# EasyEDA schematic SCH_ALL-IN-ONE_2025-01-04.json

## Sheets
1 power supply: TITLE: POWER SUPPLY; REV: 1.0; Date: 2024-12-06; Sheet: 1/1; Drawn By: jrvrcd; Company: Your Company
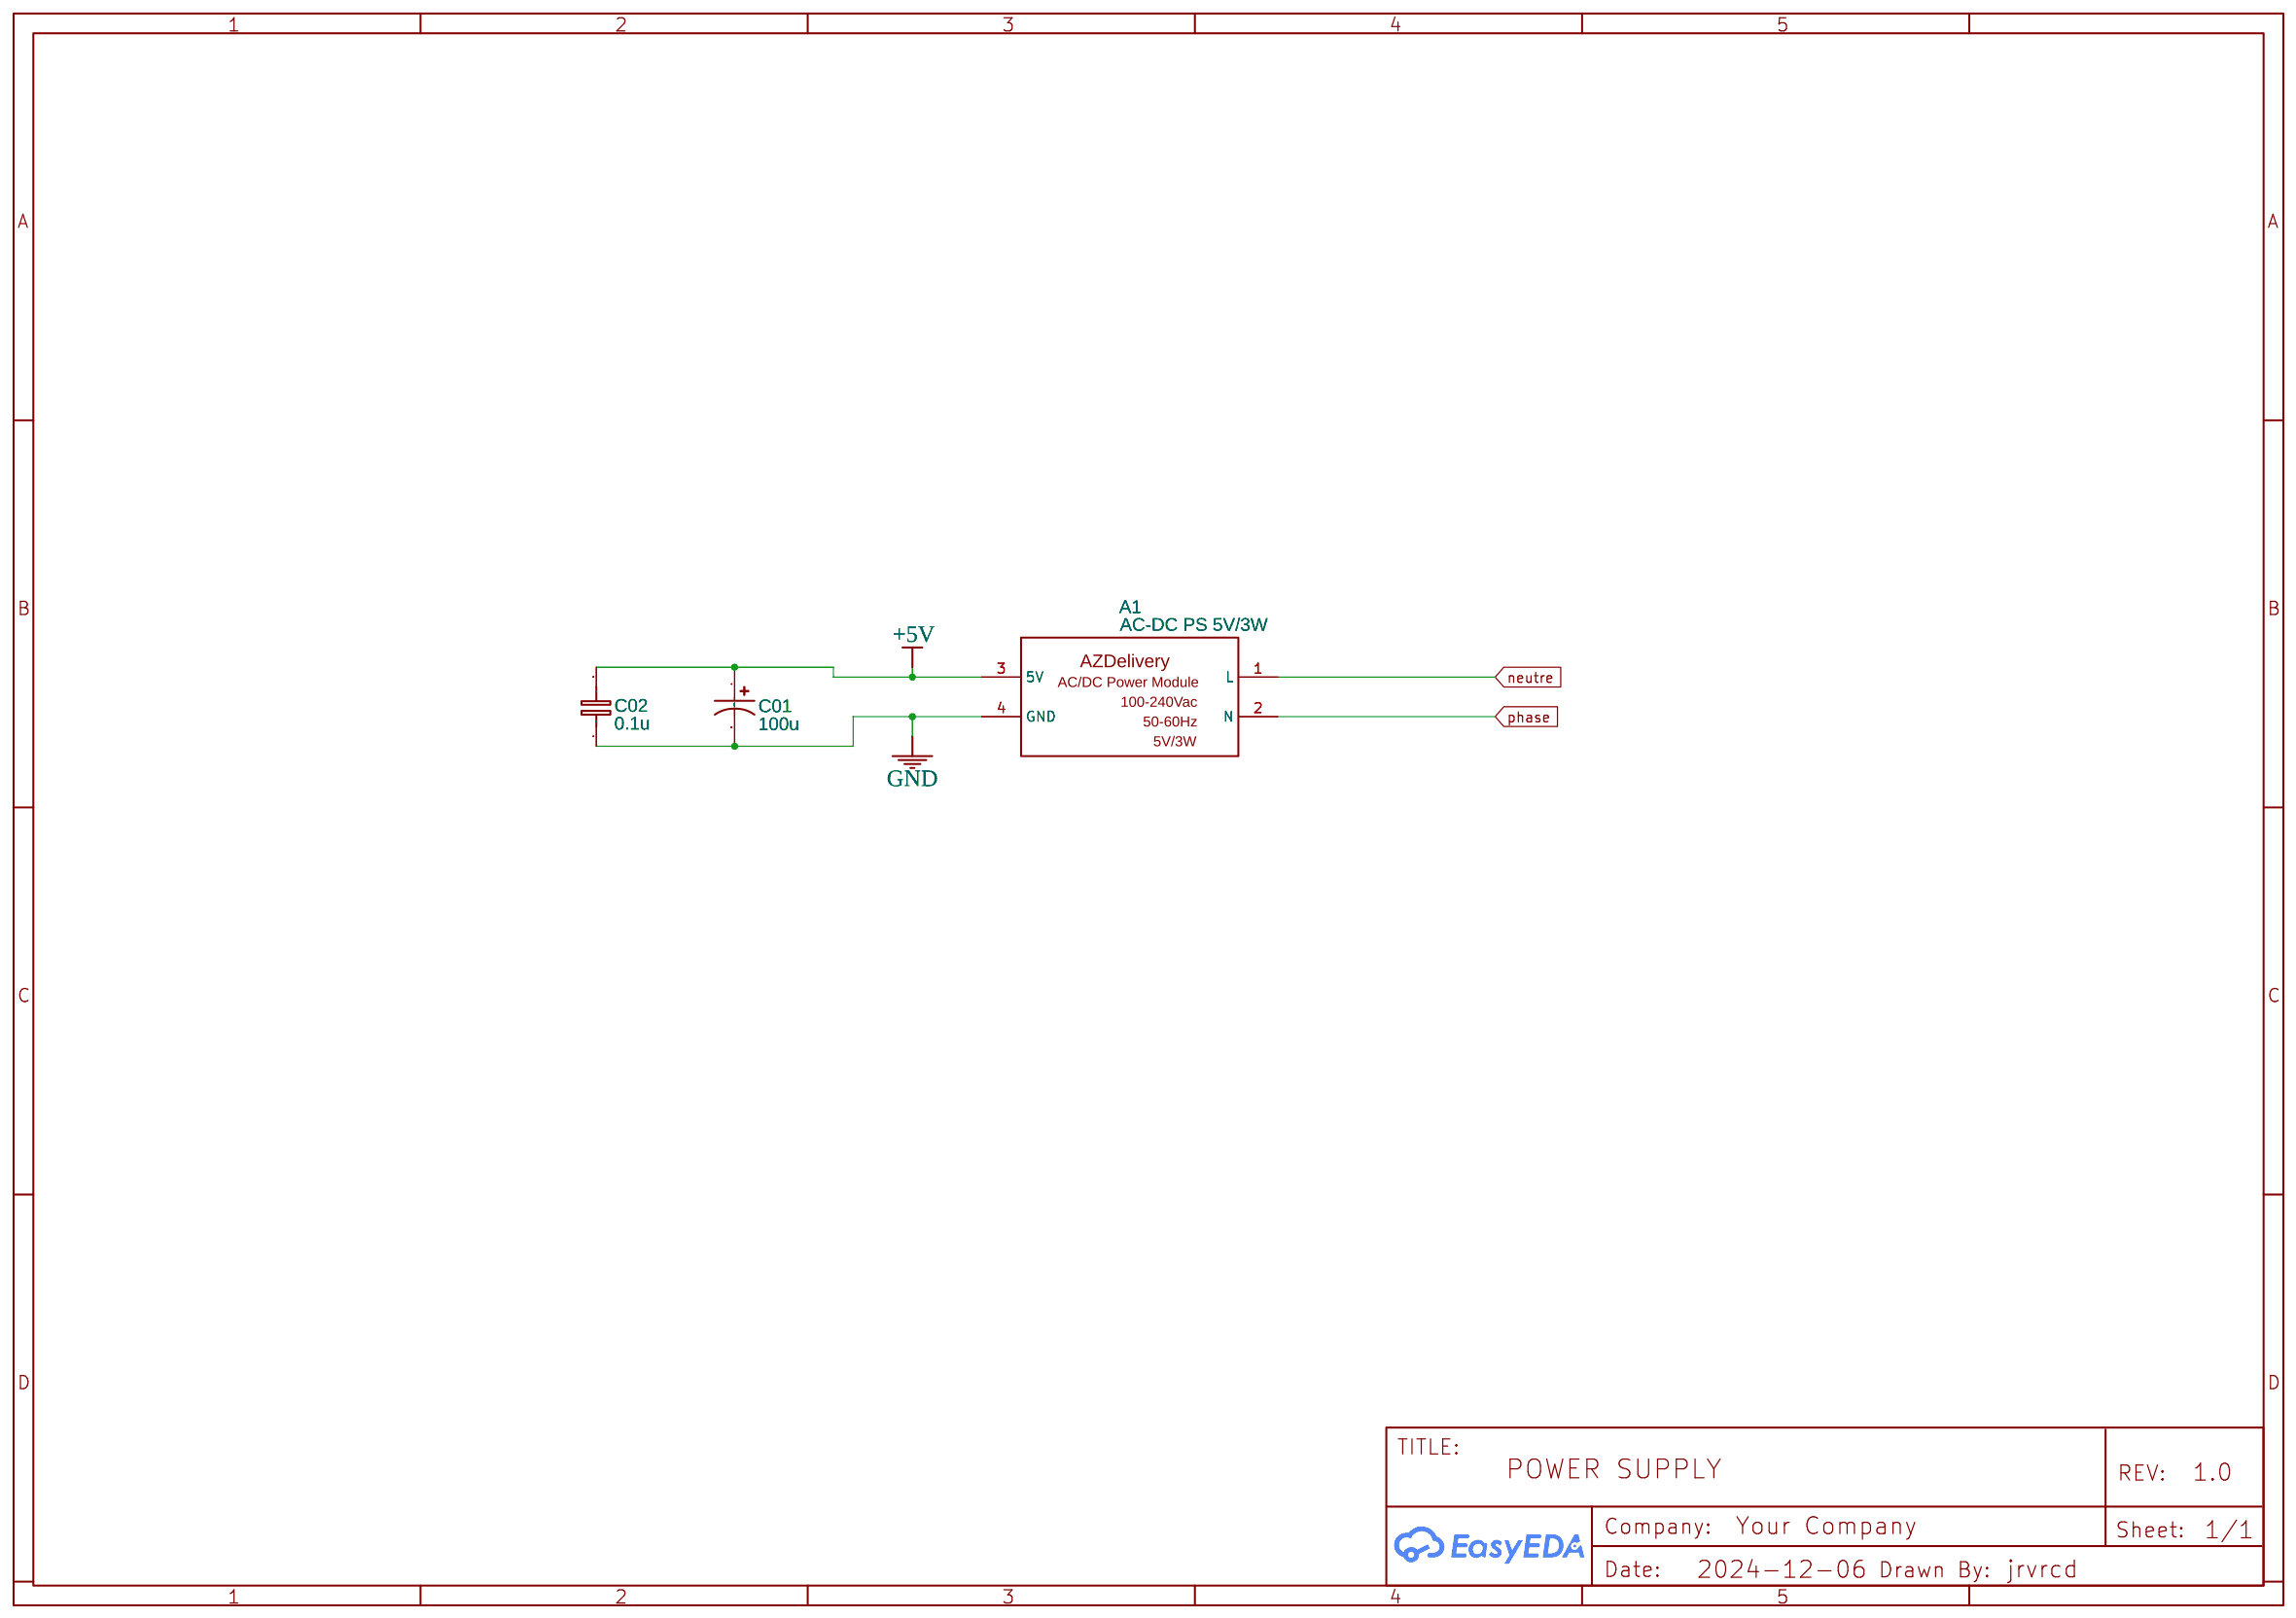
[diagram p0: power supply]
2 TIC SENSOR: TITLE: TIC SENSOR
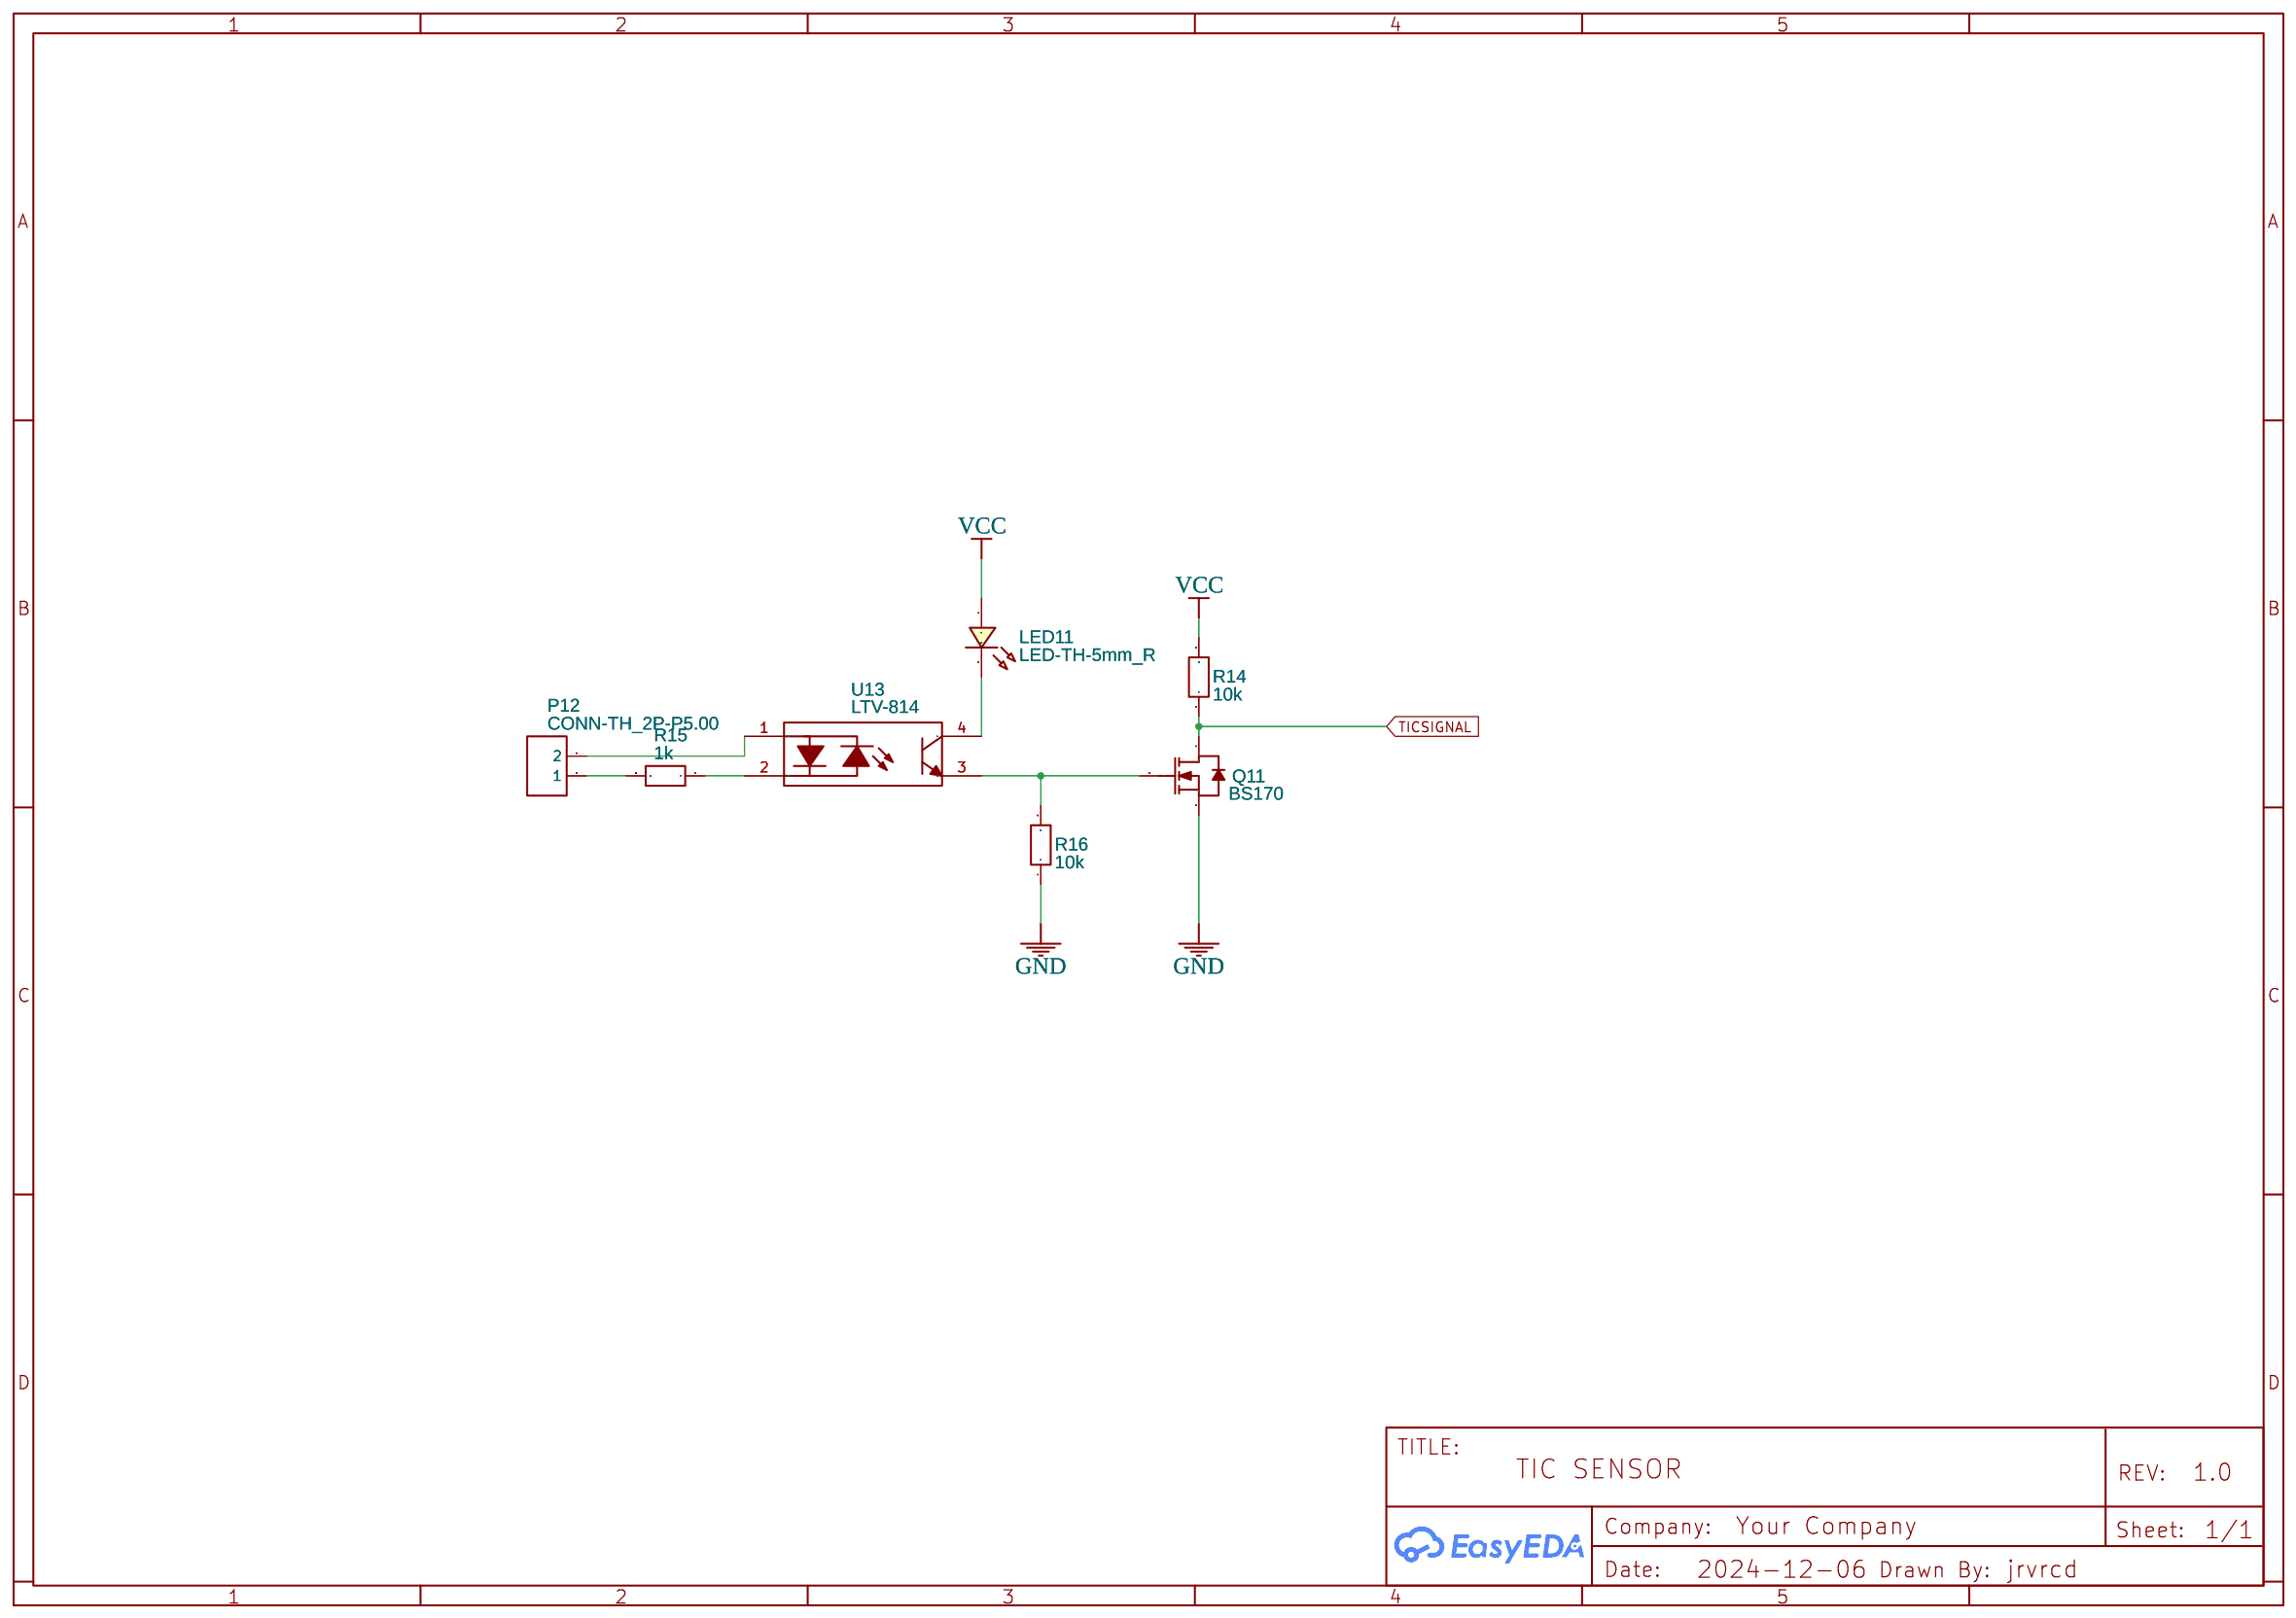
[diagram p1: TIC SENSOR]
3 POWER SENSOR: TITLE: power sensor
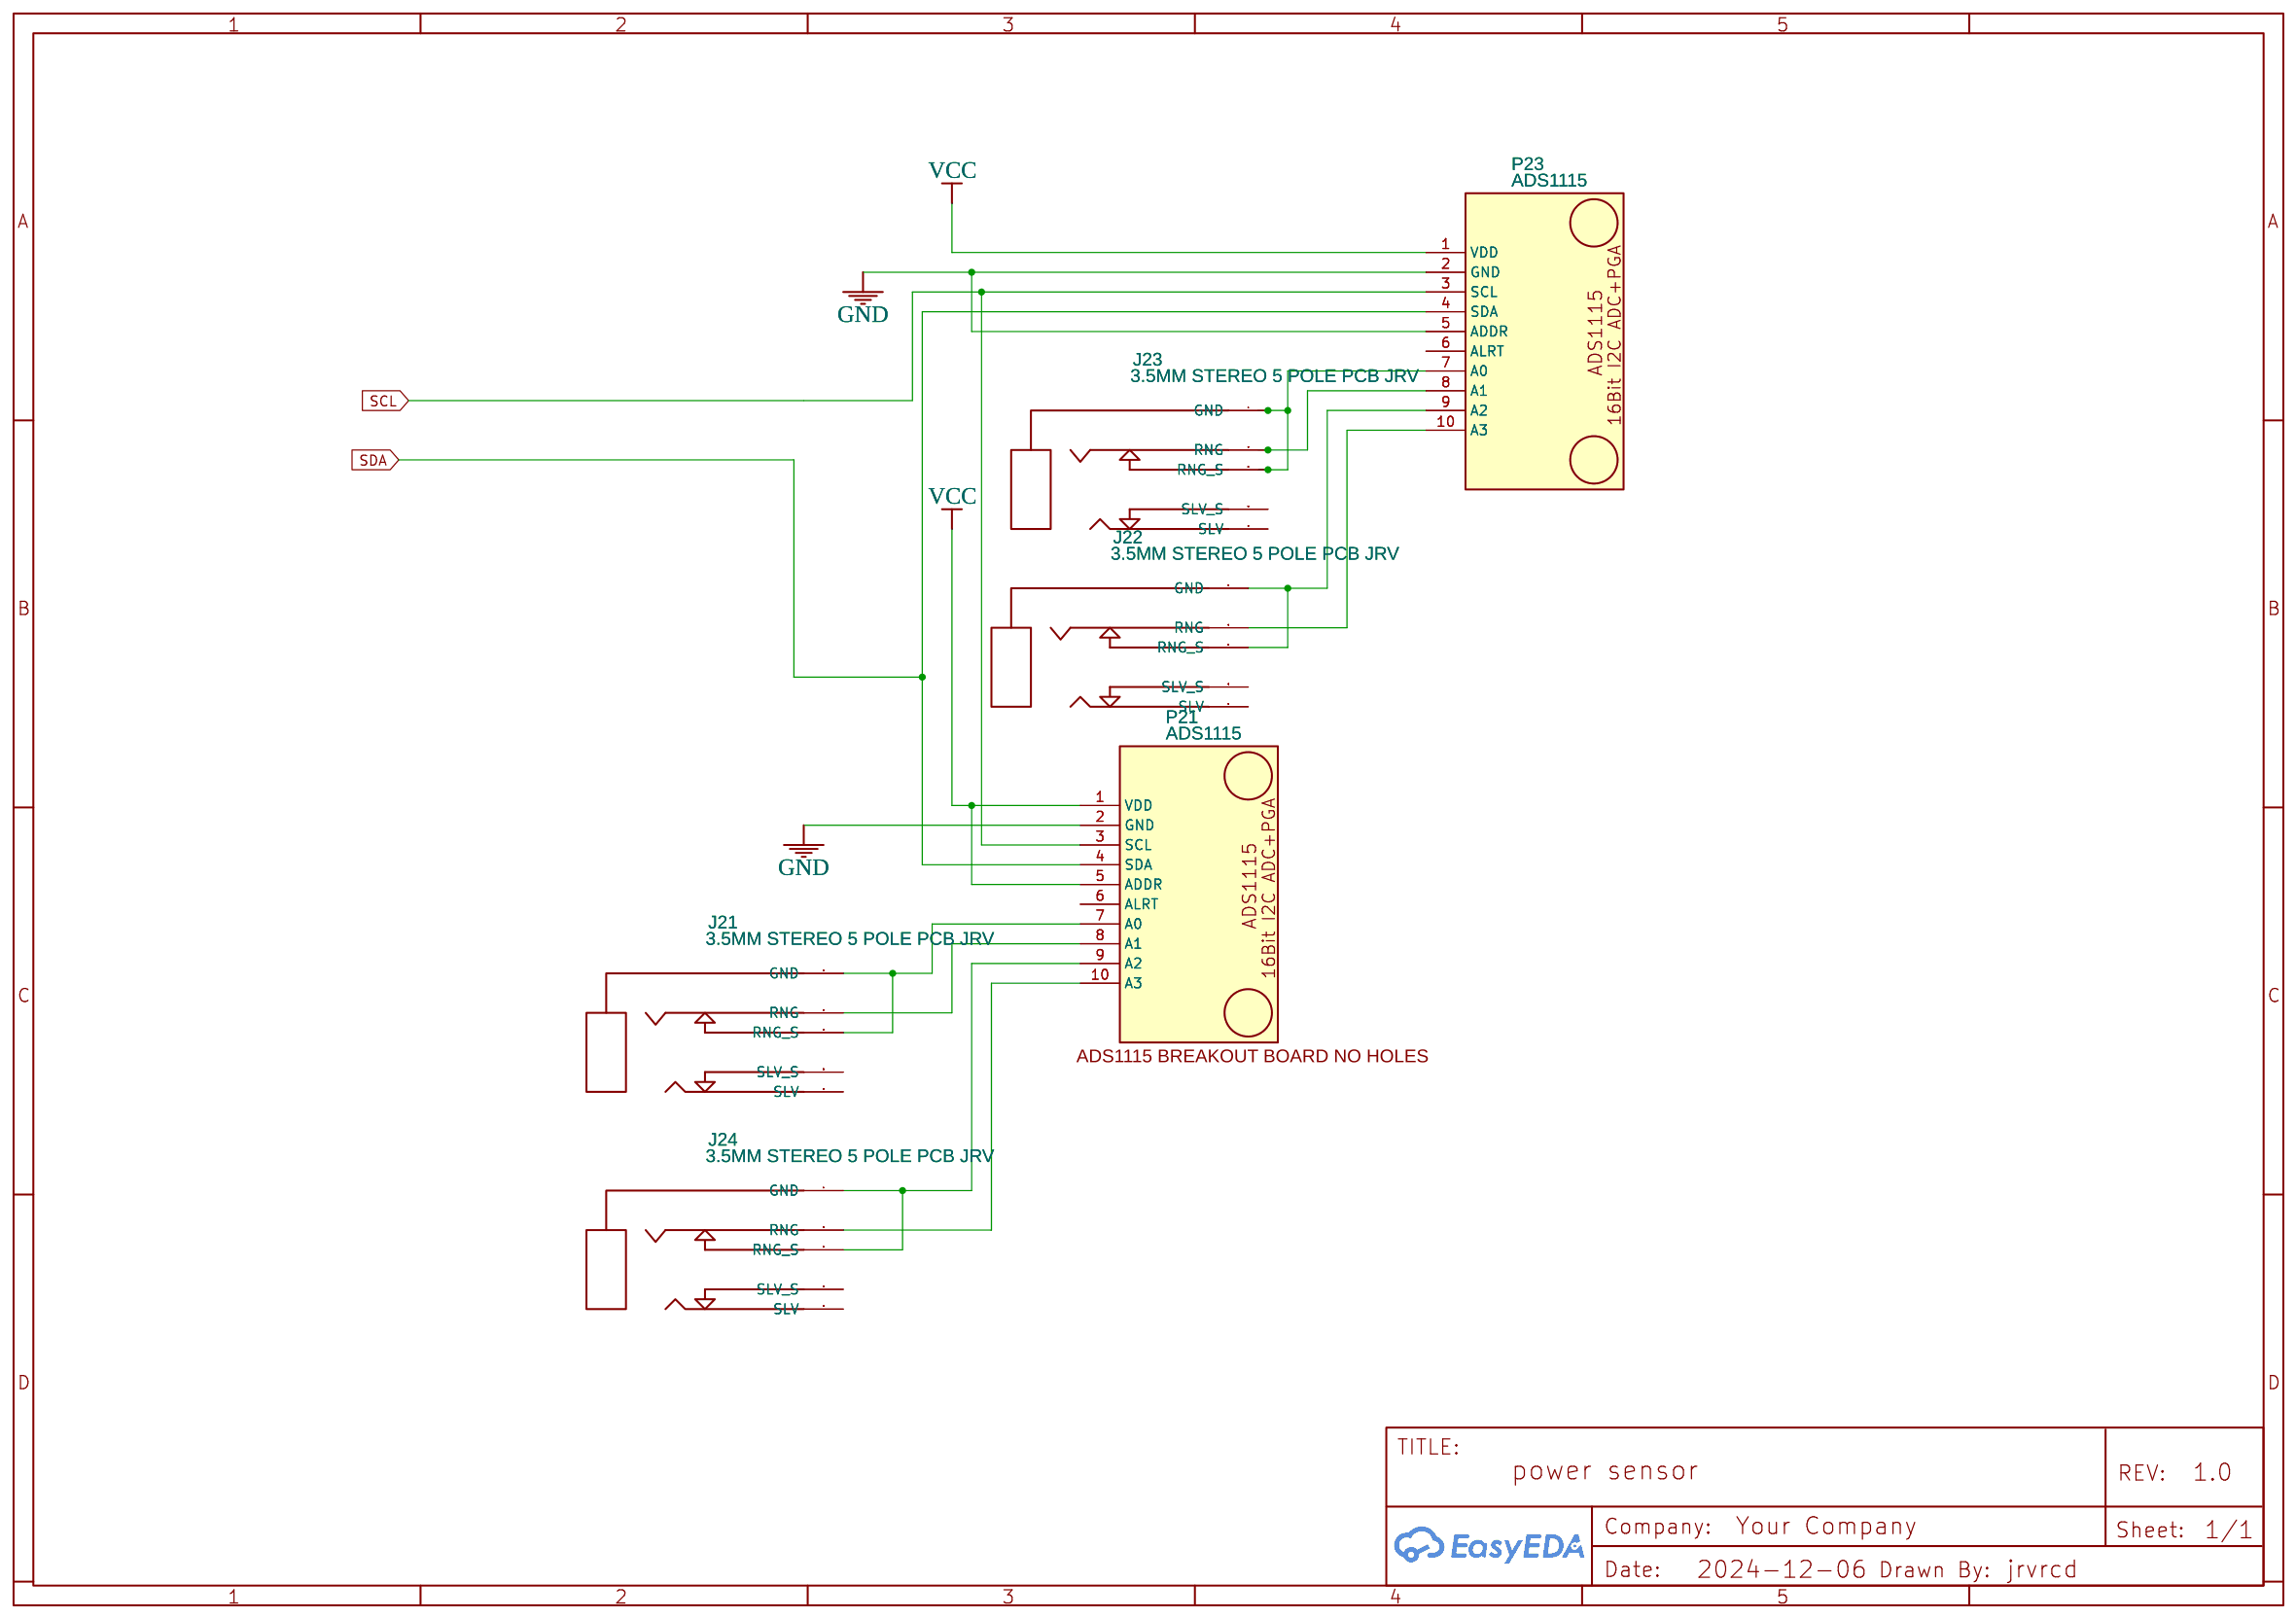
[diagram p2: POWER SENSOR]
4 main board: TITLE: main board; REV: 1.1
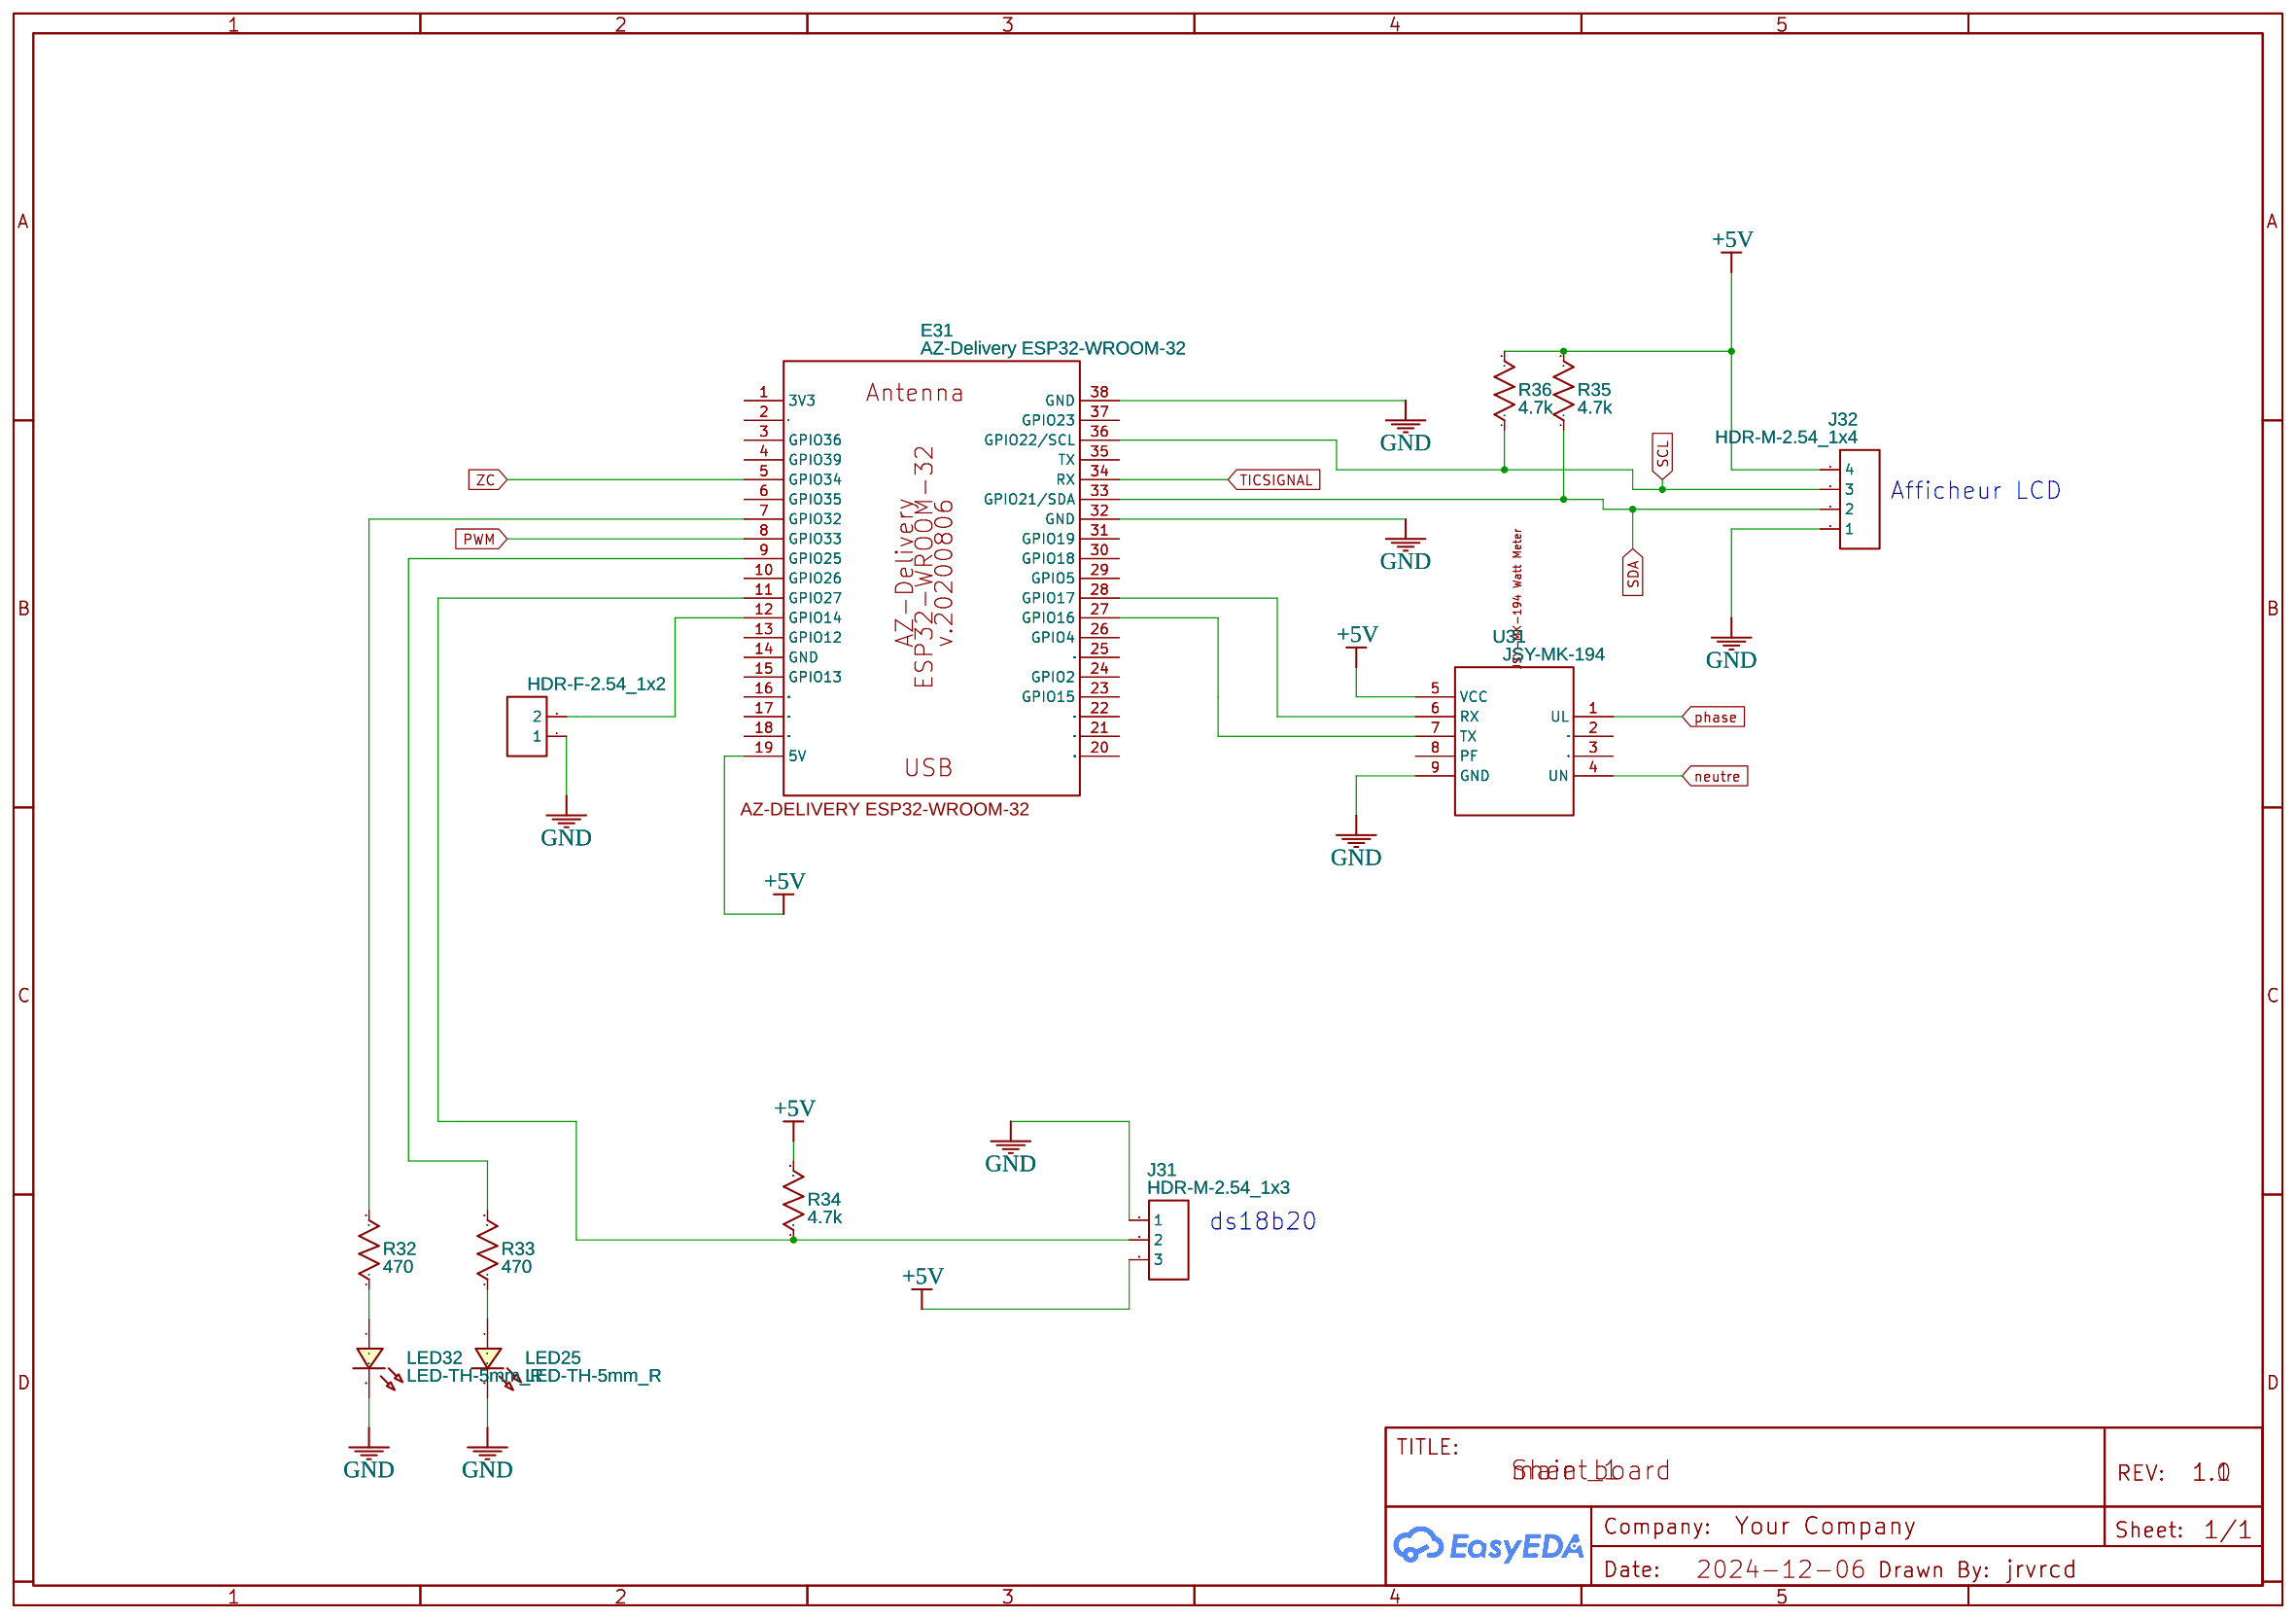
[diagram p3: main board]
5 dimmer: TITLE: dimmer
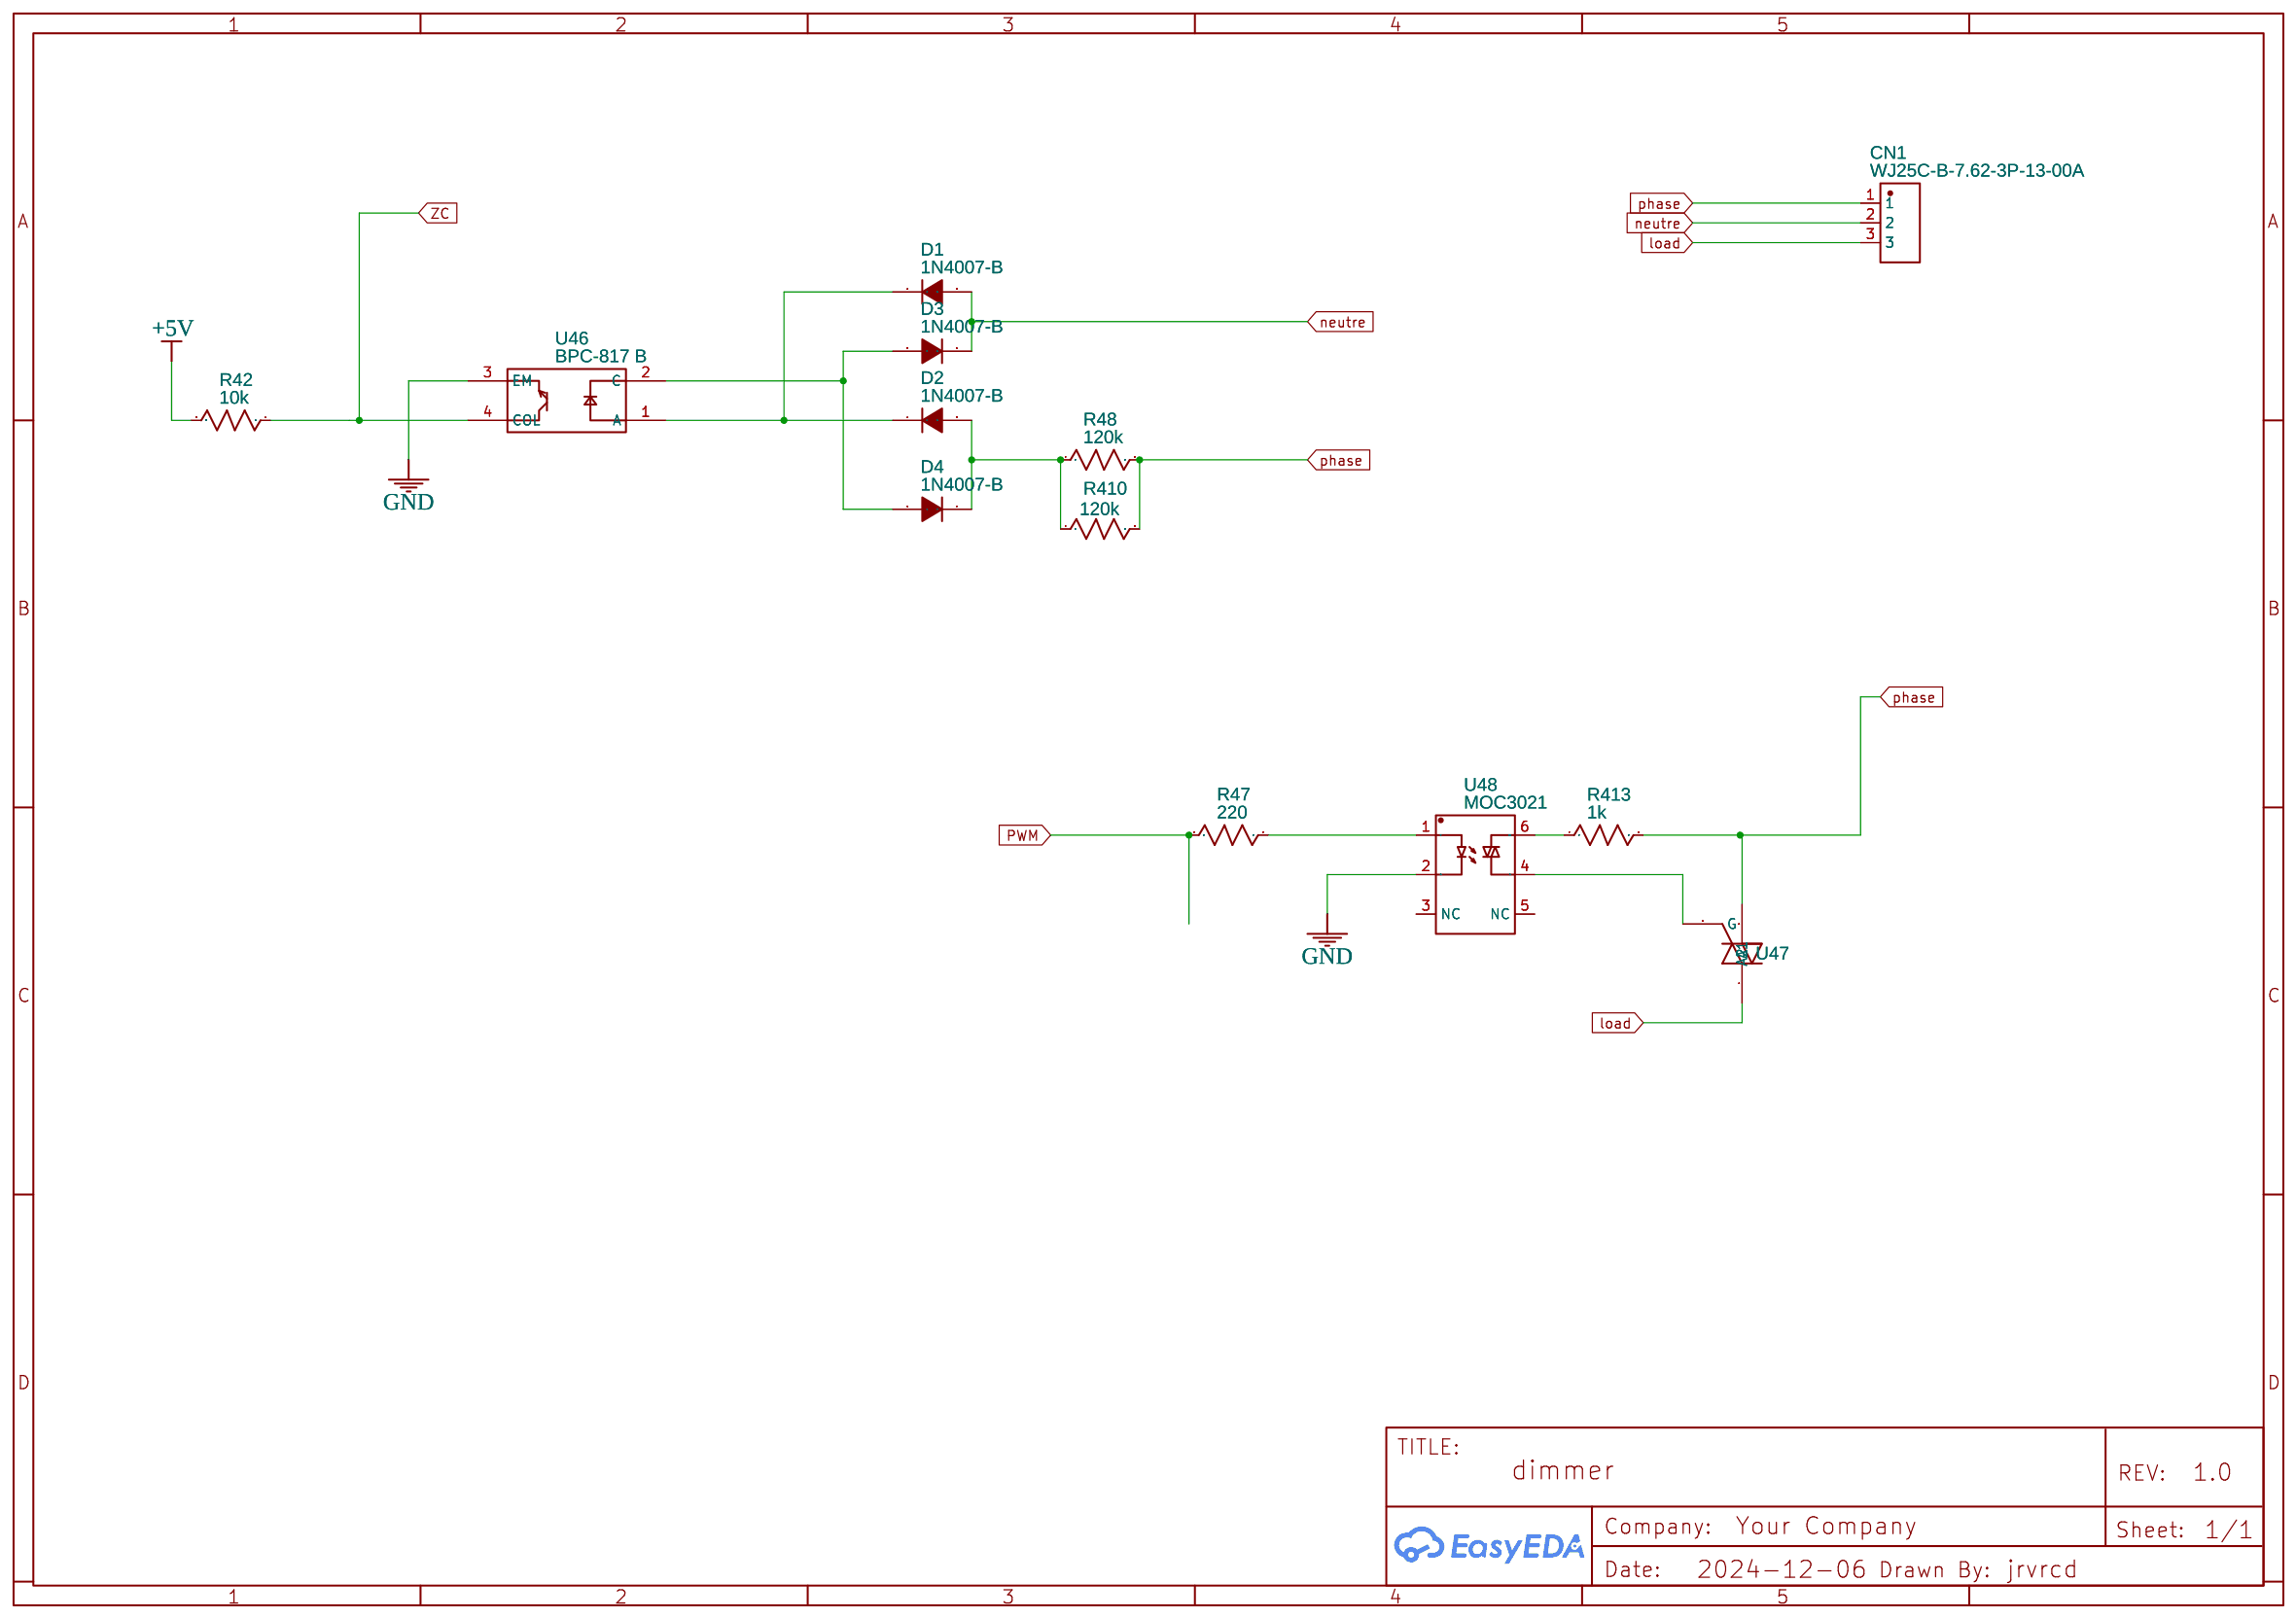
[diagram p4: dimmer]

## Parts
sheet dimmer
CN1  WJ25C-B-7.62-3P-13-00A  [CONN-TH_3P-P7.62_WJ25C-B-7.62-3P]
D1  1N4007-B  [DO-41_BD2.4-L4.7-P8.70-D0.9-RD]
D2  1N4007-B  [DO-41_BD2.4-L4.7-P8.70-D0.9-RD]
D3  1N4007-B  [DO-41_BD2.4-L4.7-P8.70-D0.9-RD]
D4  1N4007-B  [DO-41_BD2.4-L4.7-P8.70-D0.9-RD]
R42  10k  [R_AXIAL-0.3]
R47  220  [R_AXIAL-0.3]
R48  120k  [RC07]
R410  120k  [RC07]
R413  1k  [R_AXIAL-0.3]
U46  BPC-817 B  [DIP-4_L6.4-W4.6-P2.54-LS7.6-BL]
U47  NO  [BTA41]
U48  MOC3021  [MOC3021-DIP6]
sheet main board
E31  AZ-Delivery ESP32-WROOM-32  [AZ-DELIVERY ESP32-WROOM-32]
H1  HDR-F-2.54_1x2  [HDR-F-2.54_1X2]
J31  HDR-M-2.54_1x3  [HDR-M-2.54_1X3]
J32  HDR-M-2.54_1x4  [HDR-M-2.54_1X4]
LED25  LED-TH-5mm_R  [LED-TH_BD5.0_RED]
LED32  LED-TH-5mm_R  [LED-TH_BD5.0_RED]
R32  470  [R_AXIAL-0.3]
R33  470  [R_AXIAL-0.3]
R34  4.7k  [R_AXIAL-0.3]
R35  4.7k  [R_AXIAL-0.3]
R36  4.7k  [R_AXIAL-0.3]
U31  JSY-MK-194  [JSY-MK-194]
sheet POWER SENSOR
J21  3.5MM STEREO 5 POLE PCB JRV  [3.5MM STEREO 5 POLE PCB]
J22  3.5MM STEREO 5 POLE PCB JRV  [3.5MM STEREO 5 POLE PCB]
J23  3.5MM STEREO 5 POLE PCB JRV  [3.5MM STEREO 5 POLE PCB]
J24  3.5MM STEREO 5 POLE PCB JRV  [3.5MM STEREO 5 POLE PCB]
P21  ADS1115  [ADS1115 BREAKOUT BOARD NO HOLES]
P23  ADS1115  [ADS1115 BREAKOUT BOARD NO HOLES]
sheet power supply
A1  AC-DC PS 5V/3W  [AZDELIVERYAC-05-3]
C01  100u  [CAP-D8.0-F3.5]
C02  0.1u  [RAD-0.3]
sheet TIC SENSOR
LED11  LED-TH-5mm_R  [LED-TH_BD5.0_RED]
P12  CONN-TH_2P-P5.00  [CONN-TH_2P-P5.00]
Q11  BS170  [TO 92]
R14  10k  [R_AXIAL-0.3]
R15  1k  [R_AXIAL-0.3]
R16  10k  [R_AXIAL-0.3]
U13  LTV-814  [DIP-4_L6.4-W4.6-P2.54-LS7.6-BL]

## Library data of the parts
CN1 = WJ25C-B-7.62-3P-13-00A: Supplier: LCSC; Manufacturer: KANGNEX(康奈克斯电气); Manufacturer Part: WJ25C-B-7.62-3P; Supplier Part: C61583; JLCPCB Part Class: Extended Part
D1-D4 = 1N4007-B: Contributor: LCSC; Supplier: LCSC; Supplier Part: C526198; Manufacturer: Diodes Incorporated; JLCPCB Part Class: Extended Part
R32-R36 R42 R47 R48 R410 R413 = R_AXIAL-0.3_US: Contributor: LCEDA_Lib
U46 = BPC-817 B: Contributor: LCSC; Supplier: LCSC; Manufacturer: BrtLed(佰鸿); Manufacturer Part: BPC-817; Supplier Part: C117586; JLCPCB Part Class: Extended Part
U47 = BTA41: Contributor: PiotrMk; Package Display: No
U48 = MOC3021: Supplier: LCSC; Supplier Part: C123202; Manufacturer: Lite-On; Contributor: fredy1605
E31 = AZ-Delivery ESP32-WROOM-32: Contributor: lekkim; Package Display: Yes
H1 = HDR-F-2.54_1x2: Supplier Part: C49661; Supplier: LCSC; Contributor: LCEDA_Lib
J31 = HDR-M-2.54_1x3: Supplier Part: C180248; Supplier: LCSC; Contributor: LCEDA_Lib
J32 = HDR-M-2.54_1x4: Supplier Part: C124378; Supplier: LCSC; Contributor: LCEDA_Lib
LED11 LED25 LED32 = LED-TH-5mm_R: Manufacturer: EVERLIGHT(台湾亿光); Manufacturer Part: 333-2SURD/S530-A3; Supplier Part: C87271; Supplier: LCSC; Contributor: LCEDA_Lib
U31 = JSY-MK-194: Manufacturer: PEJ; Supplier: PEJ; Supplier Part: PEJ; Contributor: pcbej1
J21-J24 = 3.5MM STEREO 5 POLE PCB JRV: Contributor: Neil Simmonds; sourceId: 2ZTb5nFXf; Supplier Part: 913-1021; Supplier: RS-Online; Manufacturer Part: 913-1021; Manufacturer: RS-PRO
P21 = ADS1115: sourceId: 1T5FDZYC8; Contributor: Victor Ortiz Garcia; Package Display: Yes
P23 = ADS1115: sourceId: 1T5FDZYC8; Contributor: Victor Ortiz Garcia
A1 = AC-DC PS 5V/3W: Manufacturer: AZDelivery; Manufacturer Part: AC-05-3; Supplier: AZDelivery; Supplier Part: AC-05-3; link: https://www.az-delivery.de/products/copy-of-220v-zu-5v-mini-netzteil?_pos=5&_sid=804db0bf8&_ss=r; Contributor: djquickwilli
C01 = CE_TH_D3.0×F1.5_US: Contributor: LCEDA_Lib
C02 = C_RAD-0.3_EU: Contributor: LCEDA_Lib
P12 = CONN-TH_2P-P5.00: Supplier: LCSC; Contributor: LCEDA_Lib
Q11 = BS170: Supplier: LCSC; Manufacturer: FAIRCHILD; Supplier Part: C111691; LCSC Assembly: Yes; SMT Type: Extend
R14-R16 = R_AXIAL-0.3_EU: Contributor: LCEDA_Lib
U13 = LTV-814: Supplier: LCSC; Manufacturer: LITEON; image: //image.lceda.cn/szlcsc/C10790.jpg; Supplier Part: C10790

## Nets
+5V: A1.3(5V) C01.1 C02.2 E31.19(5V) J31.3 J32.4 R34.2 R35.2 R36.2 R42.2 U31.5(VCC)
GND: A1.4(GND) C01.2 C02.1 E31.32(GND) E31.38(GND) H1.1 J31.1 J32.1 LED25.2 LED32.2 P21.2(GND) P23.2(GND) P23.5(ADDR) Q11.3(S) R16.1 U31.9(GND) U46.3(EM) U48.2
VCC: LED11.1 P21.1(VDD) P21.5(ADDR) P23.1(VDD) R14.2
load: CN1.3 U47.1(A1)
neutre: A1.1(L) CN1.2 D1.2(A) D3.1(K) U31.4(UN)
phase: A1.2(N) CN1.1 R48.2 R410.2 R413.2 U31.1(UL) U47.2(A2)
PWM: E31.8(GPIO33) R47.2
SCL: E31.36(GPIO22/SCL) J32.3 P21.3(SCL) P23.3(SCL) R36.1
SDA: E31.33(GPIO21/SDA) J32.2 P21.4(SDA) P23.4(SDA) R35.1
TICSIGNAL: E31.34(RX) Q11.1(D) R14.1
ZC: E31.5(GPIO34) R42.1 U46.4(COL)
Net-(D1-1): D1.1(K) D2.1(K) U46.1(A)
Net-(D2-2): D2.2(A) D4.1(K) R48.1 R410.1
Net-(D3-2): D3.2(A) D4.2(A) U46.2(C)
Net-(E31-7): E31.7(GPIO32) R32.2
Net-(E31-9): E31.9(GPIO25) R33.2
Net-(E31-11): E31.11(GPIO27) J31.2 R34.1
Net-(E31-12): E31.12(GPIO14) H1.2
Net-(E31-27): E31.27(GPIO16) U31.7(TX)
Net-(E31-28): E31.28(GPIO17) U31.6(RX)
Net-(J21-1): J21.1(GND) J21.11(RNG_S) P21.7(A0)
Net-(J21-3): J21.3(RNG) P21.8(A1)
Net-(J22-1): J22.1(GND) J22.11(RNG_S) P23.9(A2)
Net-(J22-3): J22.3(RNG) P23.10(A3)
Net-(J23-1): J23.1(GND) J23.11(RNG_S) P23.7(A0)
Net-(J23-3): J23.3(RNG) P23.8(A1)
Net-(J24-1): J24.1(GND) J24.11(RNG_S) P21.9(A2)
Net-(J24-3): J24.3(RNG) P21.10(A3)
Net-(LED11-2): LED11.2 U13.4
Net-(LED25-1): LED25.1 R33.1
Net-(LED32-1): LED32.1 R32.1
Net-(P12-1): P12.1 R15.2
Net-(P12-2): P12.2 U13.1
Net-(Q11-2): Q11.2(G) R16.2 U13.3
Net-(R15-1): R15.1 U13.2
Net-(R47-1): R47.1 U48.1
Net-(R413-1): R413.1 U48.6(BASE)
Net-(U47-3): U47.3(G) U48.4(E)

Not connected (* = marked no-connect by the designer): E31 1(3V3) 2 3(GPIO36) 4(GPIO39) 6(GPIO35) 10(GPIO26) 13(GPIO12) 14(GND) 15(GPIO13) 16(GPIO9) 17(GPIO10) 18(GPIO11) 20(GPIO6) 21(GPIO7) 22(GPIO8) 23(GPIO15) 24(GPIO2) 25(GPIO0) 26(GPIO4) 29(GPIO5) 30(GPIO18) 31(GPIO19) 35(TX) 37(GPIO23); J21 2(SLV) 10(SLV_S); J22 2(SLV) 10(SLV_S); J23 2(SLV) 10(SLV_S); J24 2(SLV) 10(SLV_S); P21 6(ALRT); P23 6(ALRT); U31 2(GND) 3(GND) 8(PF); U48 3(NC) 5(NC)

## Notes on the sheets
sheet 4
- Afficheur LCD
- ds18b20
